# EAGLE design PCB(final) (EAGLE 8.4.1)
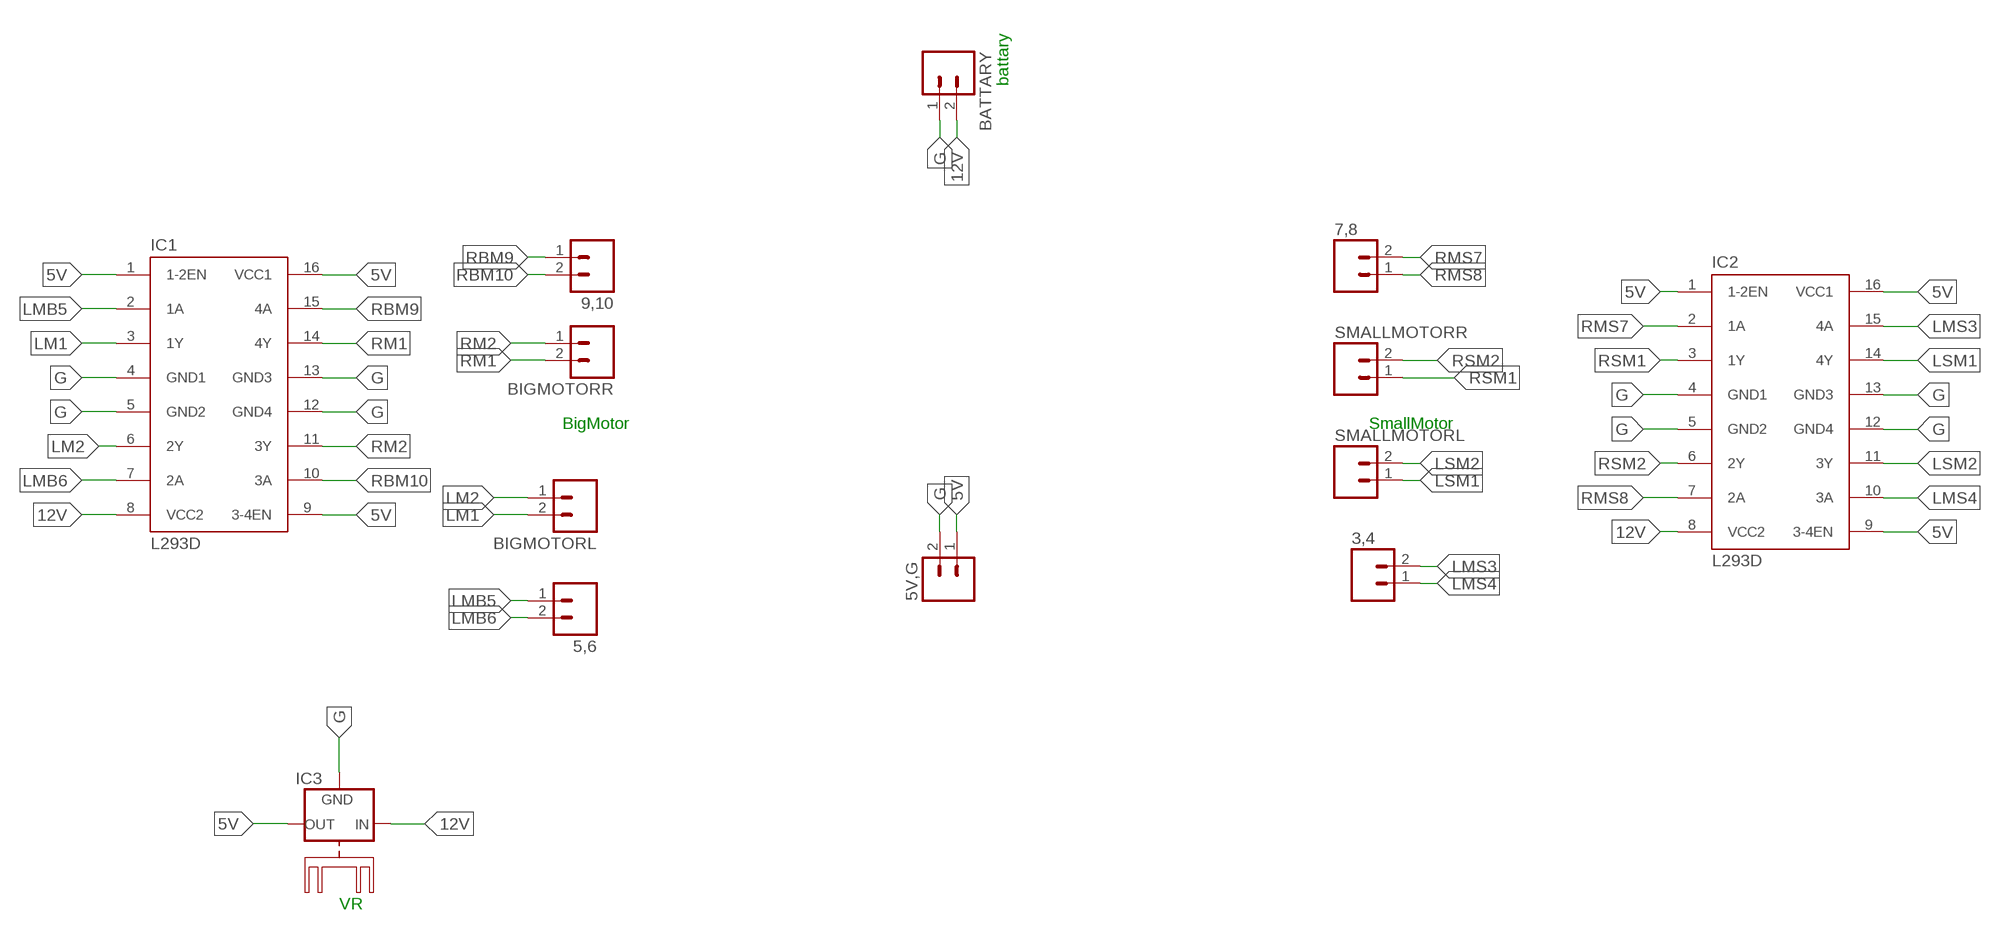
[diagram p0: schematic, sheet 1]

## Parts
3,4  M02  [02P]
5,6  M02  [02P]
5V,G  M02  [02P]
7,8  M02  [02P]
9,10  M02  [02P]
BATTARY  M02  [02P]
BIGMOTORL  M02  [02P]
BIGMOTORR  M02  [02P]
IC1  L293D  [DIL16]
IC2  L293D  [DIL16]
IC3  78XXH  [78XXH]
SMALLMOTORL  M02  [02P]
SMALLMOTORR  M02  [02P]

## Nets
5V: 5V,G.1 IC1.1(1-2EN) IC1.9(3-4EN) IC1.16(VCC1) IC2.1(1-2EN) IC2.9(3-4EN) IC2.16(VCC1) IC3.OUT
12V: BATTARY.2 IC1.8(VCC2) IC2.8(VCC2) IC3.IN
G: 5V,G.2 BATTARY.1 IC1.4(GND1) IC1.5(GND2) IC1.12(GND4) IC1.13(GND3) IC2.4(GND1) IC2.5(GND2) IC2.12(GND4) IC2.13(GND3) IC3.GND
LM1: BIGMOTORL.2 IC1.3(1Y)
LM2: BIGMOTORL.1 IC1.6(2Y)
LMB5: 5,6.1 IC1.2(1A)
LMB6: 5,6.2 IC1.7(2A)
LMS3: 3,4.2 IC2.15(4A)
LMS4: 3,4.1 IC2.10(3A)
LSM1: IC2.14(4Y) SMALLMOTORL.1
LSM2: IC2.11(3Y) SMALLMOTORL.2
RBM9: 9,10.1 IC1.15(4A)
RBM10: 9,10.2 IC1.10(3A)
RM1: BIGMOTORR.2 IC1.14(4Y)
RM2: BIGMOTORR.1 IC1.11(3Y)
RMS7: 7,8.2 IC2.2(1A)
RMS8: 7,8.1 IC2.7(2A)
RSM1: IC2.3(1Y) SMALLMOTORR.1
RSM2: IC2.6(2Y) SMALLMOTORR.2

## Notes on the sheet
- battary
- BigMotor | SmallMotor
- VR

## Library data of the parts
3,4 5,6 5V,G 7,8 9,10 BATTARY BIGMOTORL BIGMOTORR SMALLMOTORL SMALLMOTORR = con-amp-quick:M02: AMP QUICK CONNECTOR; OC_FARNELL: unknown; OC_NEWARK: unknown
IC1 IC2 = st-microelectronics:L293D: PUSH-PULL 4 CHANNEL DRIVER; MPN: L293D; OC_FARNELL: 9589619; OC_NEWARK: 56P8249
IC3 = 78xx_with_heatsink:78XXH: VOLTAGE REGULATOR

## Net classes
0 default: width 1.5 mm, drill 0.8 mm, clearance 0.2 mm

## Board
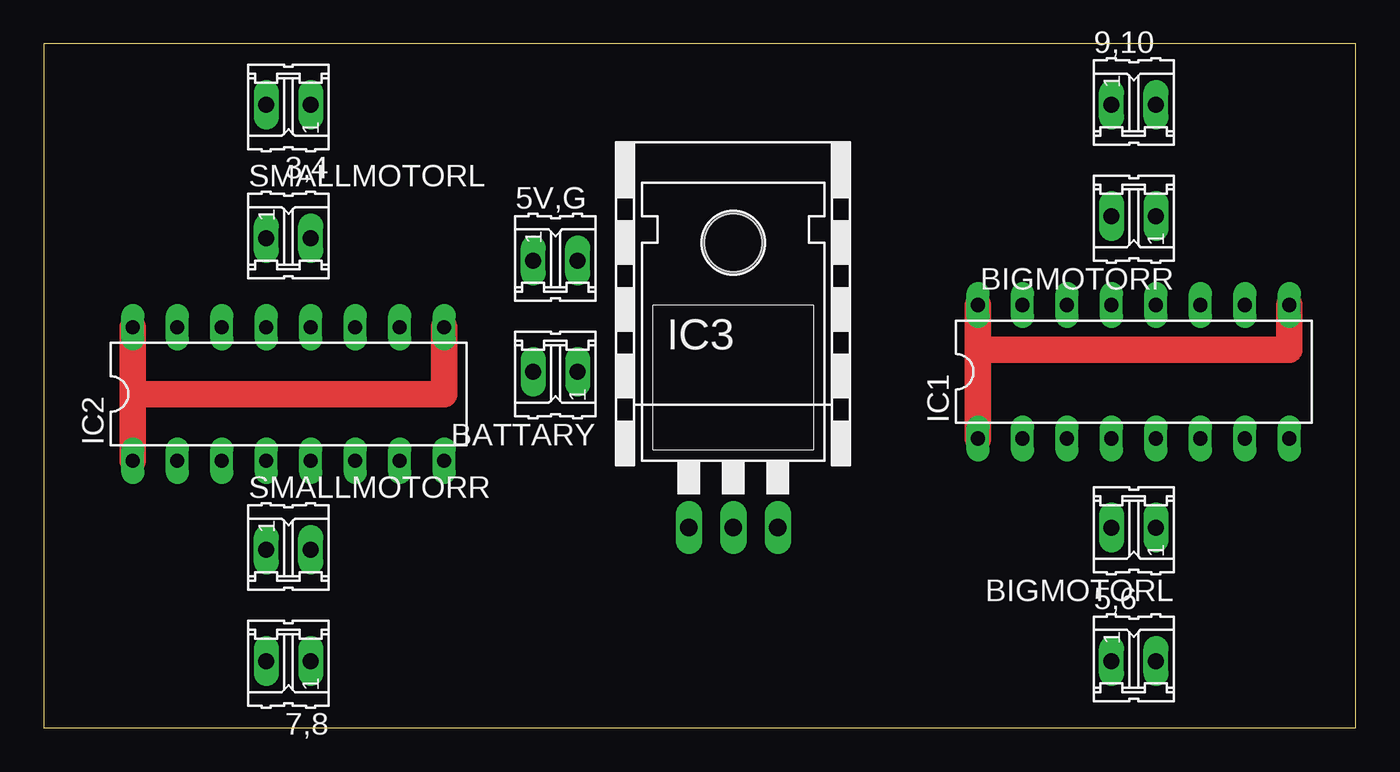
[diagram p1: board, top side]
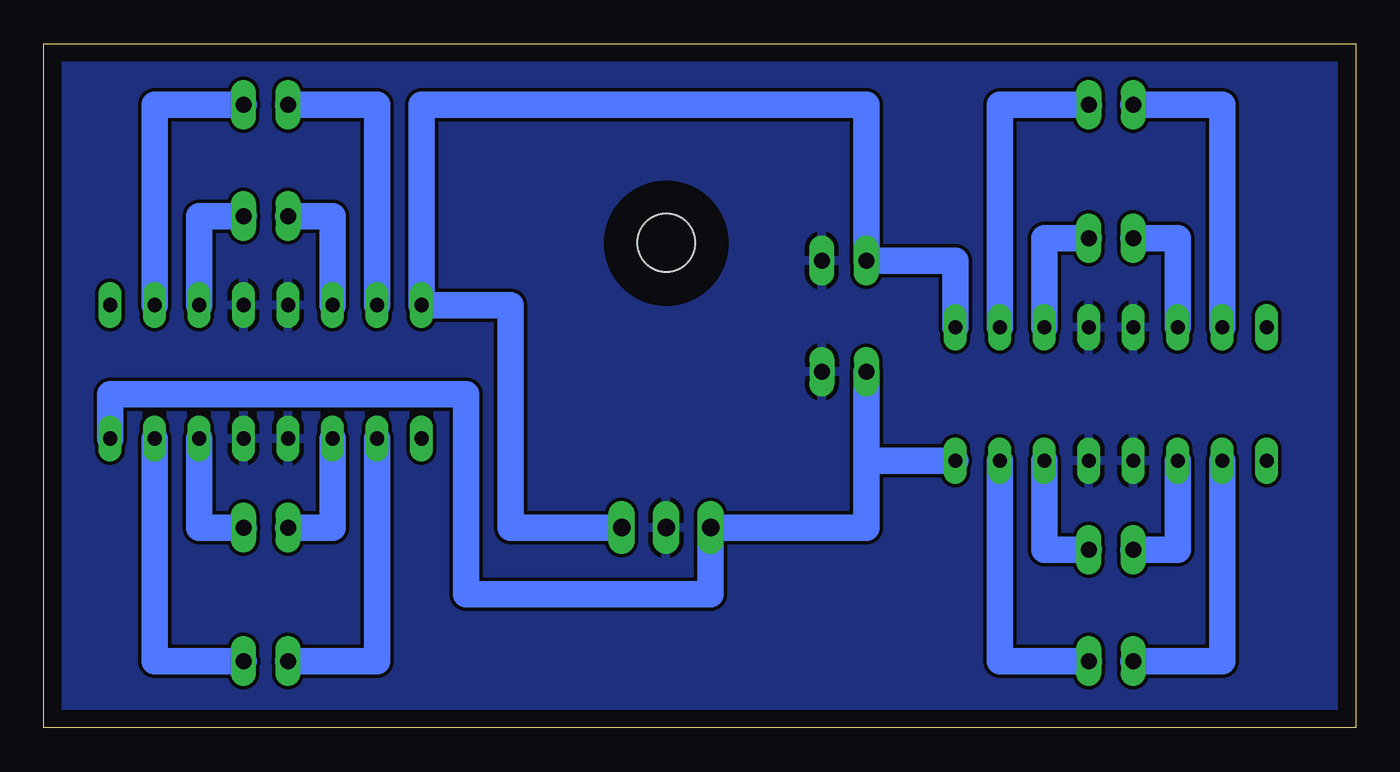
[diagram p2: board, bottom side, seen from below]

Size 74.91 x 39.04 mm. Coordinates in mm from the lower left corner, seen from the top.
Outline: 0,0 74.91,0 74.91,39.04 0,39.04 0,0
Copper layers (1*16): Top 0.035mm / dielectric 1.5mm / Bottom 0.035mm
Design rules "default": minimum track width 6mil, minimum drill 0.35mm, track to track 6mil, track to pad 6mil, pad to pad 6mil, via to via 6mil, smd to smd 6mil, copper to edge 40mil, drill to drill 6mil, minimum pad ring 10mil, minimum via ring 8mil, stop-mask expansion 4mil, vias tented up to drill 0mil, thermal gap 10mil

### Footprints (pad centres in the part's own frame; a part is rotated, then mirrored left to right if it is on the bottom)
02P = drill 0.914 long: 1 -1.27,0; 2 1.27,0
DIL16 = drill 0.813 long: 1 -8.89,-3.81; 2 -6.35,-3.81; 3 -3.81,-3.81; 4 -1.27,-3.81; 5 1.27,-3.81; 6 3.81,-3.81; 7 6.35,-3.81; 8 8.89,-3.81; 9 8.89,3.81; 10 6.35,3.81; 11 3.81,3.81; 12 1.27,3.81; 13 -1.27,3.81; 14 -3.81,3.81; 15 -6.35,3.81; 16 -8.89,3.81
78XXH = drill 1.016 long: GND 0,-5.08; IN -2.54,-5.08; OUT 2.54,-5.08 | hole 3.302: 0,11.176

### Placement (x,y rotation side)
3,4  13.97,35.56 180 top
5,6  62.23,3.81 0 top
5V,G  29.21,26.67 0 top
7,8  13.97,3.81 180 top
9,10  62.23,35.56 0 top
BATTARY  29.21,20.32 180 top
BIGMOTORL  62.23,11.43 180 top
BIGMOTORR  62.23,29.21 180 top
IC1  62.23,20.32 0 top
IC2  13.97,19.05 0 top
IC3  39.37,16.51 0 top
SMALLMOTORL  13.97,27.94 0 top
SMALLMOTORR  13.97,10.16 0 top

### Tracks (layer width: path | path; a pad name or v marks a point on that pad's centre or on a via)
5V
  Top 1.5: 5.08,19.05 IC2.16 | 5.08,19.05 IC2.1 | IC2.9 22.86,19.05 5.08,19.05 | IC1.1 53.34,21.59 | IC1.9 71.12,21.59 53.34,21.59 | 53.34,21.59 IC1.16
  Bottom 1.5: IC2.9 22.86,26.67 5V,G.1 27.94,35.56 53.34,35.56 IC1.16 48.26,24.13 48.26,11.43 IC3.OUT
12V
  Bottom 1.5: IC2.8 27.94,15.24 | 27.94,15.24 BATTARY.2 | 27.94,15.24 27.94,11.43 IC3.IN 36.83,7.62 50.8,7.62 50.8,19.05 71.12,19.05 IC1.8
G
  pour Bottom: -1.27,39.37 -1.27,-1.27 76.2,-1.27 76.2,40.64 74.93,40.64 -1.27,40.64
LM1
  Bottom 1.5: BIGMOTORL.2 58.42,11.43 IC1.3
LM2
  Bottom 1.5: BIGMOTORL.1 66.04,11.43 IC1.6
LMB5
  Bottom 1.5: 5,6.1 55.88,3.81 IC1.2
LMB6
  Bottom 1.5: 5,6.2 68.58,3.81 IC1.7
LMS3
  Bottom 1.5: 3,4.2 7.62,35.56 IC2.15
LMS4
  Bottom 1.5: 3,4.1 20.32,35.56 IC2.10
LSM1
  Bottom 1.5: SMALLMOTORL.1 10.16,27.94 IC2.14
LSM2
  Bottom 1.5: SMALLMOTORL.2 17.78,27.94 IC2.11
RBM9
  Bottom 1.5: 9,10.1 55.88,35.56 IC1.15
RBM10
  Bottom 1.5: 9,10.2 68.58,35.56 IC1.10
RM1
  Bottom 1.5: BIGMOTORR.2 58.42,29.21 IC1.14
RM2
  Bottom 1.5: BIGMOTORR.1 66.04,29.21 IC1.11
RMS7
  Bottom 1.5: 7,8.2 7.62,3.81 IC2.2
RMS8
  Bottom 1.5: 7,8.1 20.32,3.81 IC2.7
RSM1
  Bottom 1.5: SMALLMOTORR.1 10.16,10.16 IC2.3
RSM2
  Bottom 1.5: SMALLMOTORR.2 17.78,10.16 IC2.6